# Altium schematic sheet Sheet2.SchDoc
size A4; PageSetup: Record=PageOptions|CenterHorizontal=True|CenterVertical=True|PrintScale=0.97|XCorrection=1.00|YCorrection=1.00|PrintKind=2|BorderSize=5000000|LeftOffset=0|BottomOffset=0|Orientation=2|PaperLength=1000|PaperWidth=1000|Scale=100|PaperSource=7|PrintQuality=-3|MediaType=1|DitherType=10|PrintScaleMode=1|PaperKind=A4|PaperIndex=9
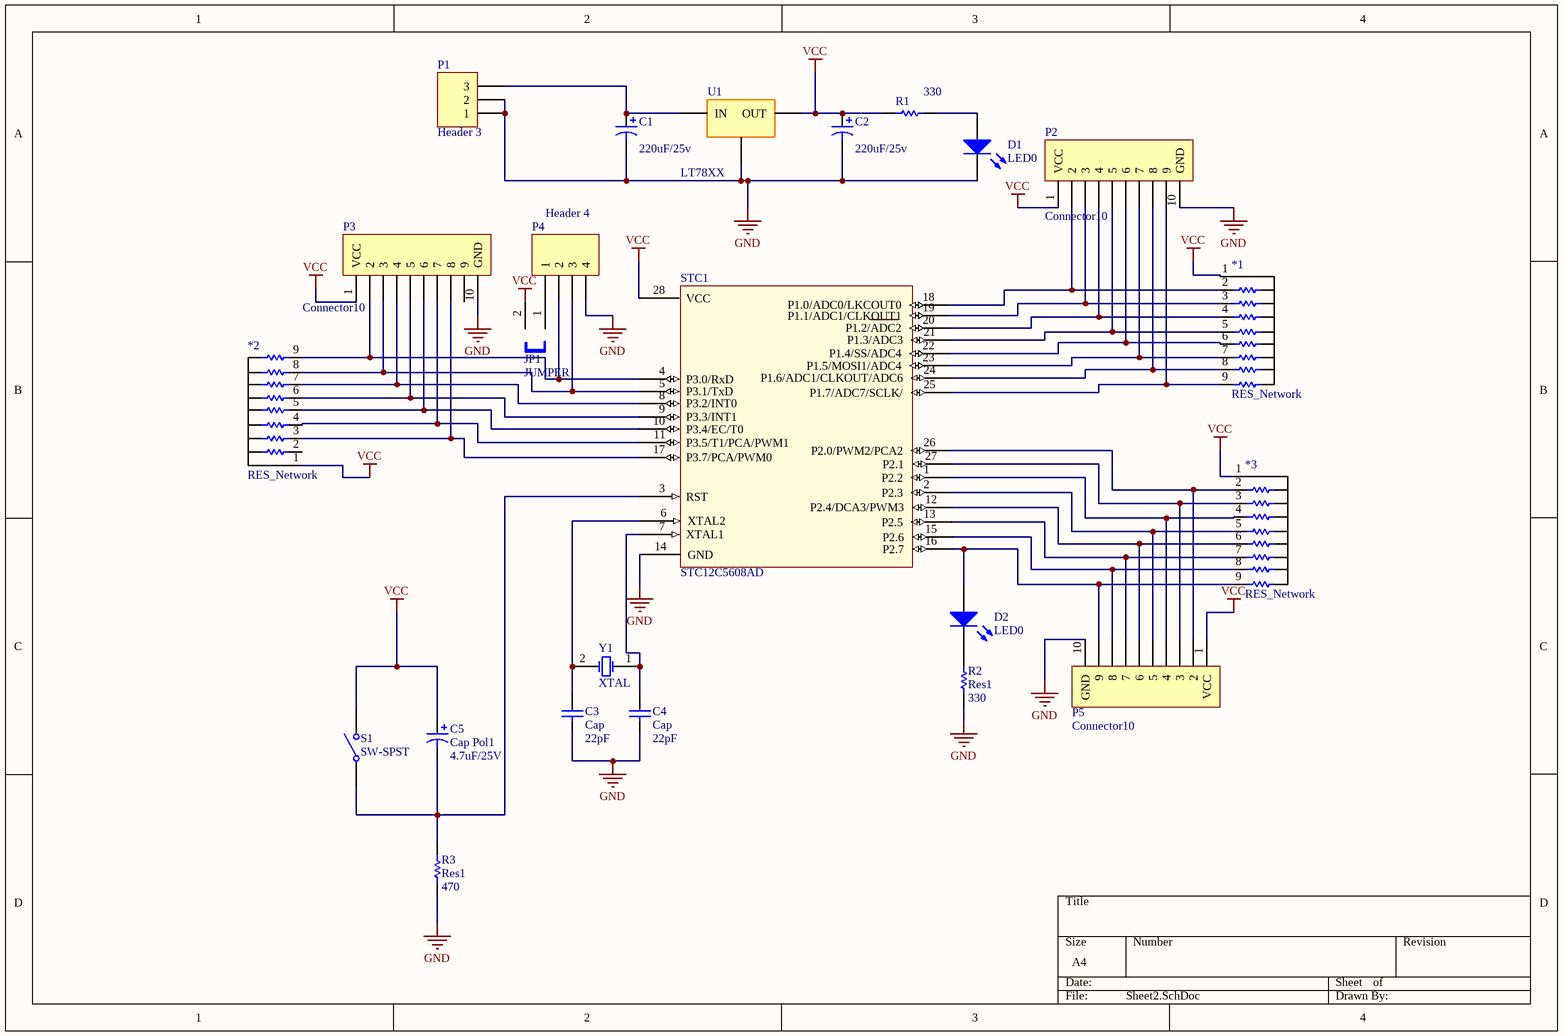
[diagram p0: Sheet2.SchDoc]

## Parts
*1  RES_Network  [RES_Network]
*2  RES_Network  [RES_Network]
*3  RES_Network  [RES_Network]
C1  value 220uF/25v  [CAPA2.5EB]  (hidden comment: Cap Pol3)
C2  value 220uF/25v  [CAPA2.5EB]  (hidden comment: Cap Pol3)
C3  Cap  value 22pF  [cap2.5mmceramic]
C4  Cap  value 22pF  [cap2.5mmceramic]
C5  Cap Pol1  value 4.7uF/25V  [CAPA2.5EBR]
D1  LED0  [ledgreen]
D2  LED0  [ledred]
JP1  JUMPER  [Jumper_1X2_Black]
P1  Header 3  [HDR1X3_MTA]
P2  Connector10  [pin10]
P3  Connector10  [pin10]
P4  Header 4  [HDR1X4_MTA]
P5  Connector10  [pin10]
R1  value 330  [RES-]  (hidden comment: Res1)
R2  Res1  value 330  [RES-]
R3  Res1  value 470  [RES-]
S1  SW-SPST  [switchbutton]
STC1  STC12C5608AD  [SO28_M]
U1  LT78XX  [to220ab]
Y1  XTAL  [Crystal]

## Nets
GND: C1.2 C2.2 C3.1 C4.1 D1.2(K) P1.1 P1.2 P2.10(GND) P3.10(GND) P4.4 P5.10(GND) R2.1 R3.1 STC1.14(GND) U1.2(GND)
VCC: *1.1 *2.1 *3.1 C2.1 C5.1 JP1.2 P2.1(VCC) P3.1(VCC) P5.1(VCC) R1.1 S1.2(NO) STC1.28(VCC) U1.3(OUT)
Net*1_2: *1.2 P2.2 STC1.18(P1.0/ADC0/LKCOUT0)
Net*1_3: *1.3 P2.3 STC1.19(P1.1/ADC1/CLKOUT1)
Net*1_4: *1.4 P2.4 STC1.20(P1.2/ADC2)
Net*1_5: *1.5 P2.5 STC1.21(P1.3/ADC3)
Net*1_6: *1.6 P2.6 STC1.22(P1.4/SS/ADC4)
Net*1_7: *1.7 P2.7 STC1.23(P1.5/MOSI1/ADC4)
Net*1_8: *1.8 P2.8 STC1.24(P1.6/ADC1/CLKOUT/ADC6)
Net*1_9: *1.9 P2.9 STC1.25(P1.7/ADC7/SCLK/)
Net*2_3: *2.3 P3.8 STC1.17(P3.7/PCA/PWM0)
Net*2_4: *2.4 P3.7 STC1.11(P3.5/T1/PCA/PWM1)
Net*2_5: *2.5 P3.6 STC1.10(P3.4/EC/T0)
Net*2_6: *2.6 P3.5 STC1.9(P3.3/INT1)
Net*2_7: *2.7 P3.4 STC1.8(P3.2/INT0)
Net*2_8: *2.8 P3.3 P4.3 STC1.5(P3.1/TxD)
Net*2_9: *2.9 P3.2 P4.2 STC1.4(P3.0/RxD)
Net*3_2: *3.2 P5.2 STC1.26(P2.0/PWM2/PCA2)
Net*3_3: *3.3 P5.3 STC1.27(P2.1)
Net*3_4: *3.4 P5.4 STC1.1(P2.2)
Net*3_5: *3.5 P5.5 STC1.2(P2.3)
Net*3_6: *3.6 P5.6 STC1.12(P2.4/DCA3/PWM3)
Net*3_7: *3.7 P5.7 STC1.13(P2.5)
Net*3_8: *3.8 P5.8 STC1.15(P2.6)
Net*3_9: *3.9 D2.1(A) P5.9 STC1.16(P2.7)
NetC1_1: C1.1 P1.3 U1.1(IN)
NetC3_2: C3.2 STC1.6(XTAL2) Y1.2(OSC2)
NetC4_2: C4.2 STC1.7(XTAL1) Y1.1(OSC1)
NetC5_2: C5.2 R3.2 S1.1(COMMON) STC1.3(RST)
NetD1_1: D1.1(A) R1.2
NetD2_2: D2.2(K) R2.2
NetJP1_1: JP1.1 P4.1

Not connected (* = marked no-connect by the designer): *2 2; P3 9

## Library data of the parts
C1 C2 = Cap Pol3: Polarized Capacitor (Surface Mount); Published: 8-Jun-2000; LatestRevisionDate: 29-May-2009; LatestRevisionNote: IPC-7351 Footprint Added.; PackageReference: C0805; Publisher: Altium Limited; PackageDescription: Chip Capacitor
C3 C4 = Cap: Capacitor; Published: 8-Jun-2000; LatestRevisionDate: 17-Jul-2002; LatestRevisionNote: Re-released for DXP Platform.; PackageReference: RAD-0.3; Publisher: Altium Limited; PackageDescription: Radial Cap, Thru-Hole; 2 Leads; 0.3 in Pin Spacing
C5 = Cap Pol1: Polarized Capacitor (Radial); Published: 8-Jun-2000; LatestRevisionDate: 17-Jul-2002; LatestRevisionNote: Re-released for DXP Platform.; PackageReference: RB7.6-15; Publisher: Altium Limited; PackageDescription: Polarized Capacitor (Radial); 2 Leads
D1 D2 = LED0: Typical INFRARED GaAs LED; Published: 8-Jun-2000; LatestRevisionDate: 08-Jul-2005; LatestRevisionNote: Mech Layer 1 removed.; PackageReference: LED-0; Publisher: Altium Limited; PackageDescription: LED; 2 Leads
P1 = Header 3: Header, 3-Pin; LatestRevisionDate: 17-Jul-2002; LatestRevisionNote: Re-released for DXP Platform.; Publisher: Altium Limited
P2 P3 P5 = Connector10: Header, 10-Pin; LatestRevisionDate: 17-Jul-2002; LatestRevisionNote: Re-released for DXP Platform.; Publisher: Altium Limited
P4 = Header 4: Header, 4-Pin; LatestRevisionDate: 17-Jul-2002; LatestRevisionNote: Re-released for DXP Platform.; Publisher: Altium Limited
R1-R3 = Res1: Resistor; Published: 8-Jun-2000; LatestRevisionDate: 17-Jul-2002; LatestRevisionNote: Re-released for DXP Platform.; PackageReference: AXIAL-0.3; Publisher: Altium Limited; PackageDescription: Axial Device, Thru-Hole; 2 Leads; 0.3 in Pin Spacing
S1 = SW-SPST: Single-Pole, Single-Throw Switch; Published: 24-Mar-1999; LatestRevisionDate: 17-Jul-2002; LatestRevisionNote: Re-released for DXP Platform.; PackageReference: SPST-2; Publisher: Altium Limited; PackageDescription: Switch; 2 Leads
U1 = 78XX
Y1 = XTAL: Crystal Oscillator; Published: 8-Jun-2000; LatestRevisionDate: 17-Jul-2002; LatestRevisionNote: Re-released for DXP Platform.; PackageReference: R38; Publisher: Altium Limited; PackageDescription: Crystal, Thru-Hole; 2 Leads; Body 3.1 x 8.2 mm (Dia.xH)